# Altium schematic sheet MPPT_Global.SchDoc: MCI Maximum Powerpoint Tracker
size A4; DrawnBy: RoS; Organization: MCI Mechatronics; DocumentNumber: MPPT_1; Revision: 1; SheetNumber: 1; SheetTotal: 6; ProjectName: MCI MPPT
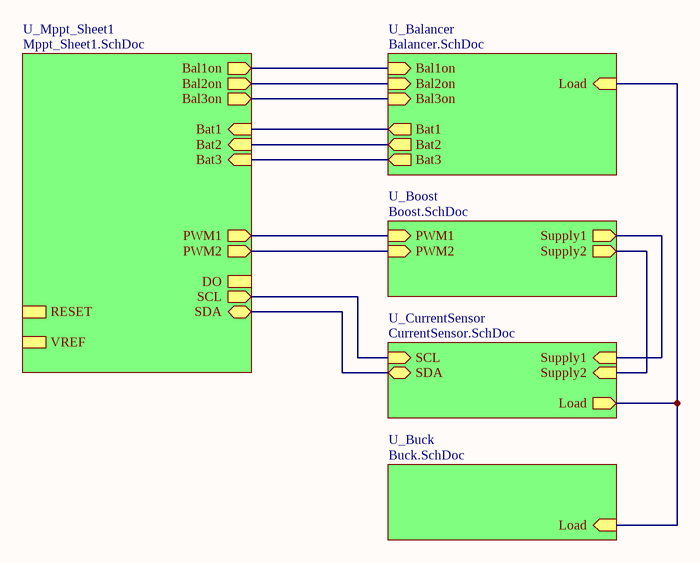
[diagram p0: MPPT_Global.SchDoc]

## Sub-sheets
U_Balancer = Balancer.SchDoc: Load (in), Bal1on (in), Bal2on (in), Bat1 (out), Bat2 (out), Bat3 (out), Bal3on (in)
U_Boost = Boost.SchDoc: PWM1 (in), Supply1 (out), PWM2 (in), Supply2 (out)
U_Buck = Buck.SchDoc: Load (in)
U_CurrentSensor = CurrentSensor.SchDoc: SCL (in), SDA (bidir), Supply1 (in), Supply2 (in), Load (out)
U_Mppt_Sheet1 = Mppt_Sheet1.SchDoc: SCL (out), RESET, DO, SDA (bidir), PWM1 (out), PWM2 (out), Bat1 (in), Bat2 (in), Bat3 (in), Bal1on (out), Bal2on (out), Bal3on (out), VREF

## Nets
(unnamed): sheet U_Mppt_Sheet1/SCL, sheet U_CurrentSensor/SCL
(unnamed): sheet U_Mppt_Sheet1/SDA, sheet U_CurrentSensor/SDA
(unnamed): sheet U_Mppt_Sheet1/PWM1, sheet U_Boost/PWM1
(unnamed): sheet U_Mppt_Sheet1/PWM2, sheet U_Boost/PWM2
(unnamed): sheet U_Mppt_Sheet1/Bat1, sheet U_Balancer/Bat1
(unnamed): sheet U_Mppt_Sheet1/Bat2, sheet U_Balancer/Bat2
(unnamed): sheet U_Mppt_Sheet1/Bat3, sheet U_Balancer/Bat3
(unnamed): sheet U_Mppt_Sheet1/Bal1on, sheet U_Balancer/Bal1on
(unnamed): sheet U_Mppt_Sheet1/Bal2on, sheet U_Balancer/Bal2on
(unnamed): sheet U_Mppt_Sheet1/Bal3on, sheet U_Balancer/Bal3on
(unnamed): sheet U_Balancer/Load, sheet U_CurrentSensor/Load, sheet U_Buck/Load
(unnamed): sheet U_Boost/Supply1, sheet U_CurrentSensor/Supply1
(unnamed): sheet U_Boost/Supply2, sheet U_CurrentSensor/Supply2

## Notes on the sheet
- Title
- Size:
- Date:
- A4
- Number:
- Time:
- Revision:
- Sheet
- of
- File: